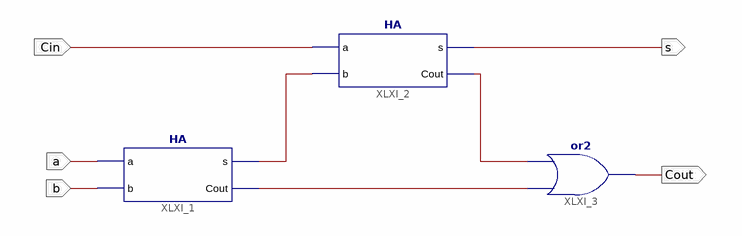
[diagram p0: schematic sheet 1]
// Xilinx ISE schematic VA.sch (spartan3e) as structural Verilog: 3 symbols, 5 ports
module VA (
  input  Cin,
  input  a,
  input  b,
  output Cout,
  output s
);

  wire XLXN_9, XLXN_10, XLXN_11;

  HA XLXI_1 (.a(a), .b(b), .s(XLXN_9), .Cout(XLXN_11));
  HA XLXI_2 (.a(Cin), .b(XLXN_9), .s(s), .Cout(XLXN_10));
  or XLXI_3 (Cout, XLXN_11, XLXN_10);
endmodule
